# Altium schematic sheet Power.SchDoc: Power
size OrCAD A; DocumentNumber: LM-003; Revision: 3.0; SheetNumber: 1; SheetTotal: 5
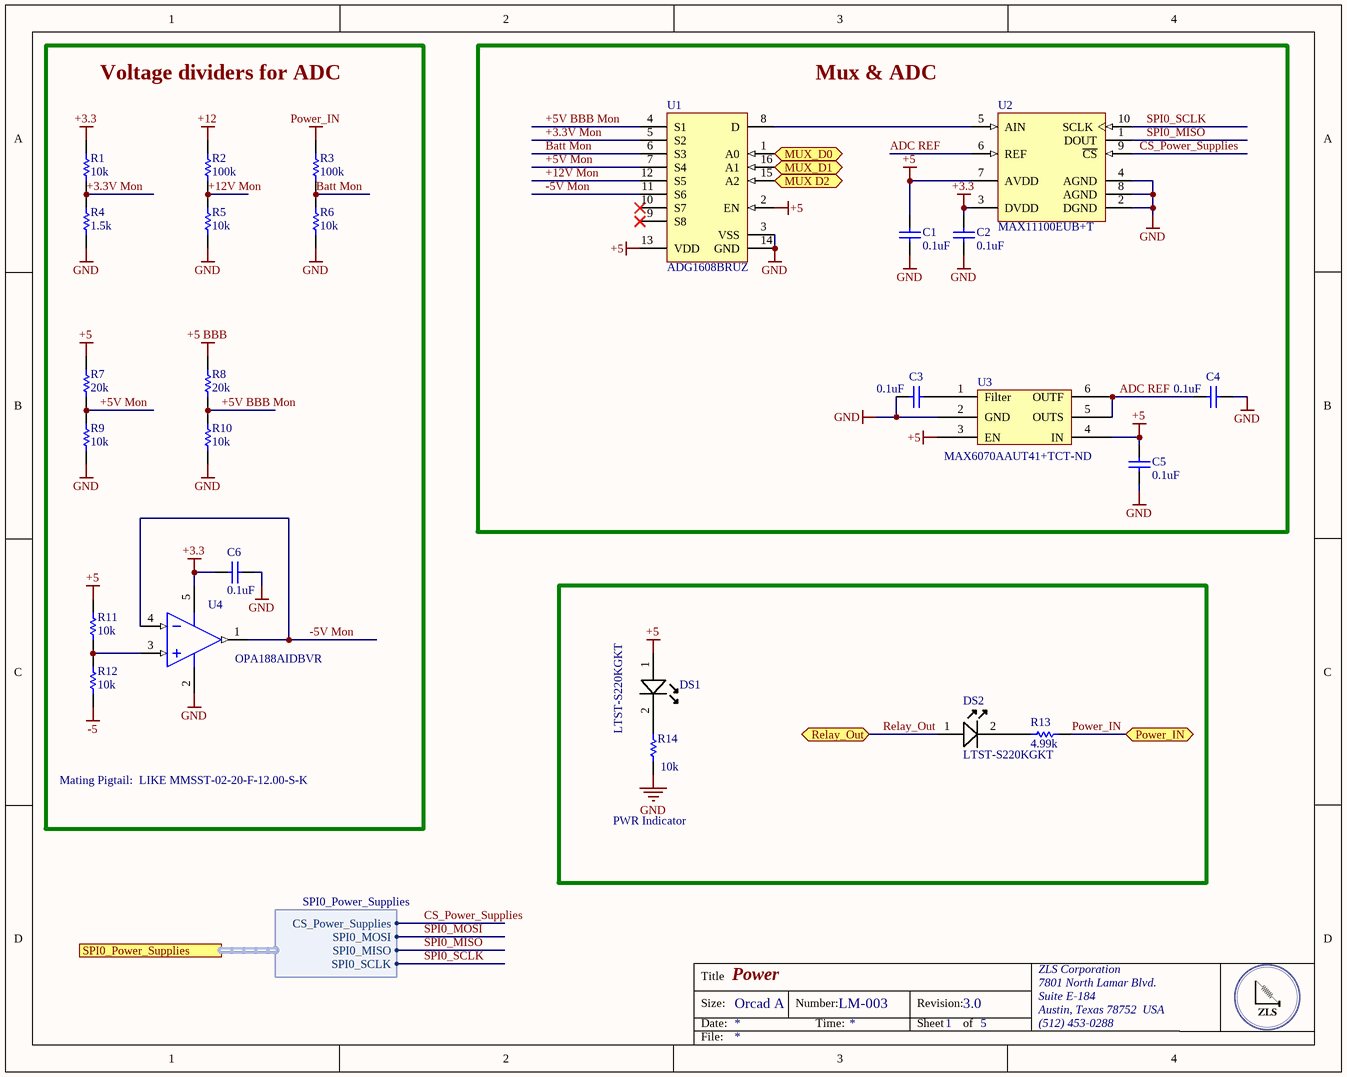
[diagram p0: Power.SchDoc]

## Parts
C1  0.1uF  [CAPC0402(1005)60_L]
C2  0.1uF  [CAPC0402(1005)60_L]
C3  0.1uF  [CAPC0402(1005)60_L]
C4  0.1uF  [CAPC0402(1005)60_L]
C5  0.1uF  [CAPC0402(1005)60_L]
C6  0.1uF  [CAPC0402(1005)60_L]
DS1  Manufacturer Part Number: LTST-S220KGKT  [0805C_L]  (hidden comment: Lite-On LTST-S220KGKT Green LED, 571 nm 2012 (0805) Side View, Rectangle Lens SMD package)
DS2  Manufacturer Part Number: LTST-S220KGKT  [0805C_L]  (hidden comment: Lite-On LTST-S220KGKT Green LED, 571 nm 2012 (0805) Side View, Rectangle Lens SMD package)
R1  10k  [RESC0402(1005)_M]
R2  100k  [RESC0402(1005)_M]
R3  100k  [RESC0402(1005)_M]
R4  1.5k  [RESC0402(1005)_M]
R5  10k  [RESC0402(1005)_M]
R6  10k  [RESC0402(1005)_M]
R7  20k  [RESC0402(1005)_M]
R8  20k  [RESC0402(1005)_M]
R9  10k  [RESC0402(1005)_M]
R10  10k  [RESC0402(1005)_M]
R11  10k  [RESC0402(1005)_M]
R12  10k  [RESC0402(1005)_M]
R13  4.99k  [RESC0402(1005)_M]
R14  10k  [RESC0402(1005)_M]
U1  ADG1608BRUZ  [ADI-RU-16_M]
U2  MAX11100EUB+T  [U10+2_L]
U3  Supplier Part Number 1: MAX6070AAUT41+TCT-ND  [SOT95P280X445-6N]  (hidden comment: MAX6070AAUT41+T)
U4  OPA188AIDBVR  [DBV0005A_M]

## Blocks framed on the sheet
Voltage dividers for ADC: C6 R1-R12 U4
Mux & ADC: C1-C5 U1-U3
PWR Indicator: DS1 DS2 R13 R14

## Ports
MUX D2, MUX_D0, MUX_D1, Power_IN, Relay_Out, SPI0_Power_Supplies (harness SPI0_Power_Supplies)

## Harnesses
SPI0_Power_Supplies: CS_Power_Supplies, SPI0_MOSI, SPI0_MISO, SPI0_SCLK

## Nets
+3.3: C2.1 C6.1 R1.2 U2.3(DVDD) U4.5(V+)
+5: C1.1 C5.1 DS1.1(A) R7.2 R11.2 U1.2(EN) U1.13(VDD) U2.7(AVDD) U3.3(EN) U3.4(IN)
+5 BBB: R8.2
+12: R2.2
-5: R12.1
GND: C1.2 C2.2 C3.2 C4.1 C5.2 C6.2 R4.1 R5.1 R6.1 R9.1 R10.1 R14.2 U1.3(VSS) U1.14(GND) U2.2(DGND) U2.4(AGND) U2.8(AGND) U3.2(GND) U4.2(V-)
Power_IN: R3.2 R13.2 ; port Power_IN
+3.3V Mon: R1.1 R4.2 U1.5(S2)
+5V BBB Mon: R8.1 R10.2 U1.4(S1)
+5V Mon: R7.1 R9.2 U1.7(S4)
+12V Mon: R2.1 R5.2 U1.12(S5)
-5V Mon: U1.11(S6) U4.1(OUT) U4.4(IN-)
ADC REF: C4.2 U2.6(REF) U3.5(OUTS) U3.6(OUTF)
Batt Mon: R3.1 R6.2 U1.6(S3)
CS_Power_Supplies: U2.9(~{CS}) ; port SPI0_Power_Supplies.CS_Power_Supplies
MUX D2: U1.15(A2) ; port MUX D2
MUX_D0: U1.1(A0) ; port MUX_D0
MUX_D1: U1.16(A1) ; port MUX_D1
Relay_Out: DS2.1(A) ; port Relay_Out
SPI0_MISO: U2.1(DOUT) ; port SPI0_Power_Supplies.SPI0_MISO
SPI0_MOSI: port SPI0_Power_Supplies.SPI0_MOSI
SPI0_SCLK: U2.10(SCLK) ; port SPI0_Power_Supplies.SPI0_SCLK
NetC3_1: C3.1 U3.1(Filter)
NetDS1_2: DS1.2(K) R14.1
NetDS2_2: DS2.2(K) R13.1
NetR11_1: R11.1 R12.2 U4.3(IN+)
NetU1_8: U1.8(D) U2.5(AIN)

Not connected (* = marked no-connect by the designer): U1 9(S8)* 10(S7)*

## Notes on the sheet
- Mating Pigtail:  LIKE MMSST-02-20-F-12.00-S-K
- Title
- Size:
- Date:
- Orcad A
- Number:
- Time:
- Revision:
- Sheet
- of
- ZLS Corporation
- 7801 North Lamar Blvd.
- Suite E-184
- Austin, Texas 78752  USA
- (512) 453-0288
- File:

## Library data of the parts
C1-C6 = CMP-1034-00252-1: CAP CER 0.1UF 10V X7R 0402; Manufacturer: Murata Electronics North America; Manufacturer Part Number: GRM155R71A104KA01D; Tolerance: ±10%; Supplier 1: Digi-Key; Supplier Part Number 1: 490-6321-1-ND; RoHS: RoHS Compliant; Category: Capacitors; Stock 1: 2920395; Pricing 1: 1=0.1, 10=0.014, 100=0.0063, 500=0.00446, 1000=0.00351, 2500=0.00319, 5000=0.00293 (USD); Packaging: Cut Tape (CT); Part Status: Active; Voltage - Rated: 10V; Temperature Coefficient: X7R; Operating Temperature: -55°C ~ 125°C; Features: -; Ratings: -; Applications: General Purpose; Mounting Type: Surface Mount, MLCC; Package / Case: 0402 (1005 Metric); Size / Dimension: 0.039" L x 0.020" W (1.00mm x 0.50mm); Height - Seated (Max): -; Thickness (Max): 0.022" (0.55mm); Lead Spacing: -; ComponentLink1URL: http://www.murata.com/~/media/webrenewal/support/library/catalog/products/capacitor/mlcc/c02e.ashx?la=en-us; ComponentLink1Description: http://www.murata.com/~/media/webrenewal/support/library/catalog/products/capacitor/mlcc/c02e.ashx?la=en-us
DS1 DS2 = LED A/K: Manufacturer: Vishay / Lite-On; Lens Colour: Colorless; Viewing Angle: 130°; Luminous Intensity: 35mcd; Forward Current: 20mA; Forward Voltage: 2V; Lens Style: Diffused,Colorless; Power Rating: 75mW; Dominant Wavelength: 568nm; Lens Transparency: Clear; Number of Elements: 1; Power Dissipation: 75W; Wavelength: 574nm; Supplier 1: Digi-Key; Supplier Part Number 1: 160-1468-1-ND; Stock 1: 74800; Pricing 1: 1=0.29, 10=0.212, 25=0.1564, 100=0.1117, 250=0.0759, 500=0.067, 1000=0.0525 (USD); Mount: Surface Mount; Case/Package: 0805; Number of Pins: 2; Colour: Green; Case Code (Metric): 2012; Case Code (Imperial): 0805; Min Operating Temperature: -55°C; Max Operating Temperature: 85°C; Packaging: Tape and Reel; Package Quantity: 4000; Illumination Colour: Green; Test Current: 20mA; Number of LEDs: 1; Length: 2.1mm; Height: 0.6mm; Width: 1mm; Depth: 0.6mm; Radiation Hardening: No; Lead Free: Lead Free; ComponentLink1URL: https://datasheet.ciiva.com/11775/0900766b80dc0b70-11775441.pdf; ComponentLink1Description: https://datasheet.ciiva.com/11775/0900766b80dc0b70-11775441.pdf; ComponentLink2URL: https://datasheet.ciiva.com/2110/s-110-ltst-s220kgkt-2110069.pdf; ComponentLink2Description: https://datasheet.ciiva.com/2110/s-110-ltst-s220kgkt-2110069.pdf; ComponentLink3URL: https://datasheet.ciiva.com/2110/s-110-ltst-s220kgkt-2110070.pdf; ComponentLink3Description: https://datasheet.ciiva.com/2110/s-110-ltst-s220kgkt-2110070.pdf; ComponentLink4URL: https://datasheet.ciiva.com/12400/100-ltst-s220kgkt-59602-12400886.pdf; ComponentLink4Description: https://datasheet.ciiva.com/12400/100-ltst-s220kgkt-59602-12400886.pdf; ComponentLink5URL: https://datasheet.ciiva.com/2110/s-110-ltst-s220kgkt-2110071.pdf; ComponentLink5Description: https://datasheet.ciiva.com/2110/s-110-ltst-s220kgkt-2110071.pdf; ComponentLink6URL: https://datasheet.ciiva.com/16379/ltst-s220kgkt-16379082.pdf; ComponentLink6Description: https://datasheet.ciiva.com/16379/ltst-s220kgkt-16379082.pdf
  DS2: Supplier 2: Farnell; Supplier Part Number 2: 2062310; RoHS: YES; Stock 2: 2271; Pricing 2: 1=0.325, 10=0.317, 100=0.23, 200=0.228, 400=0.182, 900=0.147, 3000=0.114, 9000=0.107 (GBP); ComponentLink7URL: http://www.farnell.com/cad/2124774.pdf; ComponentLink7Description: http://www.farnell.com/cad/2124774.pdf; ComponentLink8URL: http://www.farnell.com/datasheets/693084.pdf; ComponentLink8Description: http://www.farnell.com/datasheets/693084.pdf
R1-R14 = CMP-1011-00651-1
U1 = CMP-0793-00136-1: 4.5 Ohm Ron, 8-Channel +/-5 V,+12 V, +5 V and +3.3 V Multiplexer, 16-pin SOP (RU-16), Tube; Manufacturer: Analog Devices; Max Analog Signal Range: 0 to Vdd; Ron (ohms): 4.4; t transition (s): 150n; Bandwidth (Hz): 40M, 40M, 37M, 34M; Code_JEDEC: MO-153AB; PackageReference: RU-16; PackageDescription: 16-Pin Thin Shrink Small Outline Package, Body 5 x 4.4 mm, Pitch 0.65 mm; ComponentLink1Description: Manufacturer URL; ComponentLink2Description: Datasheet; PartNumber: ADG1608BRUZ; Mounting Technology: Surface Mount; PackageVersion: Nov-02; ComponentLink3Description: Package Specification; DatasheetVersion: Rev. 0; Packing: Tube; ComponentLink1URL: http://www.analog.com/en/index.html; ComponentLink3URL: http:/www.analog.com/static/imported-files/packages/36244347913743854010197452789RU16.pdf; ComponentLink2URL: http://www.analog.com/static/imported-files/data_sheets/ADG1608_1609.pdf
U2 = CMP-0249-00017-1: 16-Bit, +5V, 200ksps ADC with 10uA Shutdown, 10-Pin uMAX, -40°C to +85°C, Pb-Free, Tape and Reel; DatasheetVersion: Rev 1, Jan-2012; ComponentLink3URL: http://pdfserv.maxim-ic.com/package_dwgs/21-0061.PDF; PackageReference: U10+2; ComponentLink2URL: http://datasheets.maxim-ic.com/en/ds/MAX11100.pdf; PackageVersion: revL, 2008; ComponentLink1Description: Manufacturer URL; Code_JEDEC: MO-187-BA; ComponentLink1URL: http://www.maxim-ic.com; ComponentLink3Description: Package Specification; PackageDescription: 10-Pin Micro-MAX Thin Shrink Small Outline (uSOP), 3 x 3 x 0.85 mm Body, 0.5 mm Pitch, Pb-Free; ComponentLink2Description: Datasheet
U3 = MAX6070AAUT41+T: IC VREF SERIES 4.096V SOT23; Manufacturer: Maxim Integrated; Output Type: Fixed; Tolerance: ±0.04%; Temperature Coefficient: 6ppm/°C; Noise - 0.1Hz to 10Hz: 9.6µVp-p; Noise - 10Hz to 10kHz: 9µVrms; Voltage - Input: 4.3 V ~ 5.5 V; Current - Supply: 350µA; Supplier 1: Digi-Key; Manufacturer Part Number: MAX6070AAUT41+T; RoHS: RoHS Compliant; Category: Integrated Circuits (ICs); Stock 1: 2623; Pricing 1: 1=3.41, 10=3.213, 25=2.5704, 50=2.4418, 100=2.2491, 250=2.13344, 500=2.05634 (USD); Packaging: Cut Tape (CT); Part Status: Active; Reference Type: Series; Voltage - Output (Min/Fixed): 4.096V; Operating Temperature: -40°C ~ 125°C (TA); Mounting Type: Surface Mount; Package / Case: SOT-23-6; Supplier Device Package: SOT-23-6; ComponentLink1URL: https://datasheets.maximintegrated.com/en/ds/MAX6070-MAX6071.pdf; ComponentLink1Description: https://datasheets.maximintegrated.com/en/ds/MAX6070-MAX6071.pdf
U4 = CMP-0809-00005-2: Precision, Low Noise, Rail-to-Rail Output, Zero-Drift Operational Amplifier, 4 to 36 V, -40 to 125 degC, 5-pin SOT23 (DBV5), Green (RoHS & no Sb/Br); Manufacturer: Texas Instruments; Total Supply Voltage(Min)(+5V is 5, +/-5V is 10): 4; Offset Drift(Typ)(uV/C): 0.03; Rating: Catalog; SubFamily: Zero Drift Precision Amplifier; GBW(Typ)(MHz): 2; Slew Rate(Typ)(V/us): 0.8; Number of Channels: 1; CMRR(Min)(dB): 120; Iq per channel(Max)(mA): 0.51; Total Supply Voltage(Max)(+5V is 5, +/-5V is 10): 36; PartNumber: OPA188AIDBVR; ComponentLink2Description: Datasheet; ComponentLink2URL: http://www.ti.com/lit/ds/symlink/opa188.pdf; ComponentLink1Description: Manufacturer URL; Mounting Technology: Surface Mount; Eco-Plan: Green (RoHS & no Sb/Br); ComponentLink1URL: http://www.ti.com/; PackageVersion: 4073253-4/K, 03/2006; DatasheetVersion: SBOS642A; ComponentLink3Description: Package Specification; PackageReference: DBV0005A; ComponentLink3URL: http://www.ti.com/litv/pdf/mpds018i; PackageDescription: 5-Pin Plastic Small Outline, Body 1.6 x 2.9 mm, Pitch 0.95 mm; Code_JEDEC: MO-178